# Altium schematic sheet 1608卡-原理图2.SchDoc
size A3
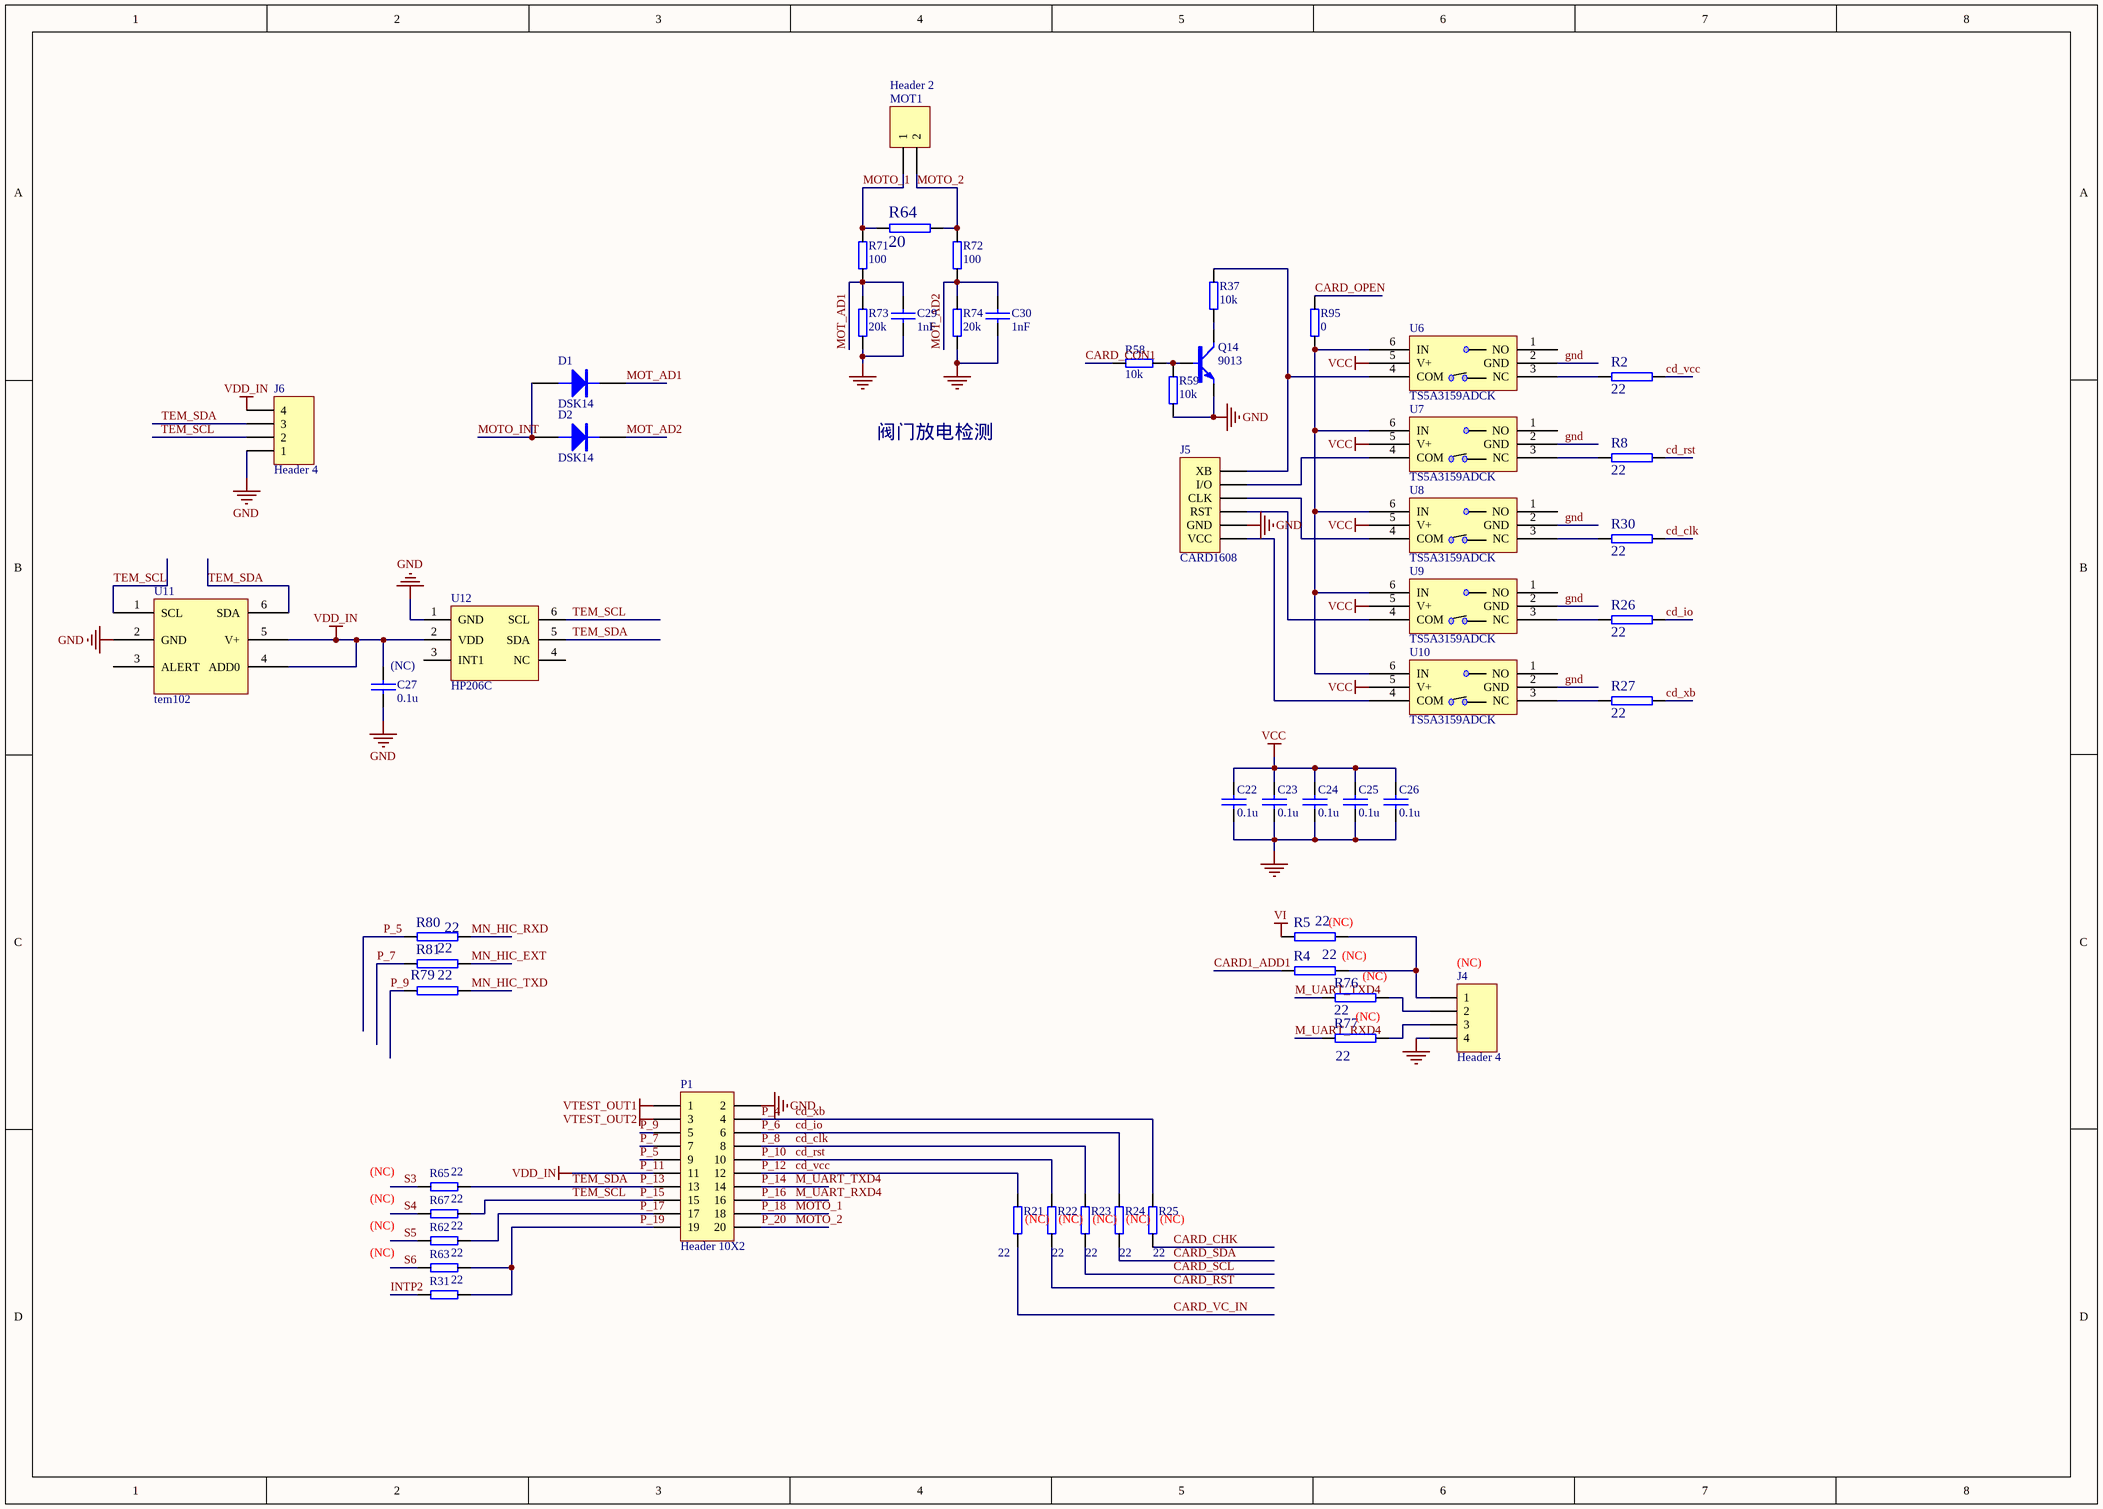
[diagram p0: 1608卡-原理图2.SchDoc]

## Parts
C22  0.1u  [C0603]
C23  0.1u  [C0603]
C24  0.1u  [C0603]
C25  0.1u  [C0603]
C26  0.1u  [C0603]
C27  0.1u  [C0603]
C29  1nF  [C0603]
C30  1nF  [C0603]
D1  DSK14  [LL34]
D2  DSK14  [LL34]
J4  Header 4  [HDX4]
J5  CARD1608  [SMT-1.25-6]
J6  Header 4  [SMT-1.25-4]
MOT1  Header 2  [HDR1X2]
P1  Header 10X2  [HDR2X10]
Q14  9013  [SOT-23-TRAN]
R2  22  [R0603]
R4  22  [R0603]
R5  22  [R0603]
R8  22  [R0603]
R21  22  [R0603]
R22  22  [R0603]
R23  22  [R0603]
R24  22  [R0603]
R25  22  [R0603]
R26  22  [R0603]
R27  22  [R0603]
R30  22  [R0603]
R31  22  [R0603]
R37  10k  [R0603]
R58  10k  [R0603]
R59  10k  [R0603]
R62  22  [R0603]
R63  22  [R0603]
R64  20  [R1206]
R65  22  [R0603]
R67  22  [R0603]
R71  100  [R0603]
R72  100  [R0603]
R73  20k  [R0603]
R74  20k  [R0603]
R76  22  [R0603]
R77  22  [R0603]
R79  22  [R0603]
R80  22  [R0603]
R81  22  [R0603]
R95  0  [R0603]
U6  TS5A3159ADCK  [SOT-23(6)]
U7  TS5A3159ADCK  [SOT-23(6)]
U8  TS5A3159ADCK  [SOT-23(6)]
U9  TS5A3159ADCK  [SOT-23(6)]
U10  TS5A3159ADCK  [SOT-23(6)]
U11  tem102  [SOP6]
U12  HP206C  [HP206C-TEST]

## Nets
gnd: C22.2 C23.2 C24.2 C25.2 C26.2 C27.1 C29.1 C30.1 J4.4 J5.5(GND) J6.1 P1.2 Q14.E R59.2 R73.2 R74.2 U6.2(GND) U7.2(GND) U8.2(GND) U9.2(GND) U10.2(GND) U11.2(GND) U12.1(GND)
P_11: C27.2 J6.4 P1.11 U11.4(ADD0) U11.5(V+) U12.2(VDD)  [also labelled VDD_IN]
VCC: C22.1 C23.1 C24.1 C25.1 C26.1 U6.5(V+) U7.5(V+) U8.5(V+) U9.5(V+) U10.5(V+)
VI: R5.2
VTEST_OUT1: P1.1
VTEST_OUT2: P1.3
CARD1_ADD1: R4.1
CARD_CHK: R25.1
CARD_CON1: R58.2
CARD_OPEN: R95.2
CARD_RST: R22.1
CARD_SCL: R23.1
CARD_SDA: R24.1
CARD_VC_IN: R21.1
cd_clk: P1.8 R23.2 R30.2  [also labelled P_8]
cd_io: P1.6 R24.2 R26.2  [also labelled P_6]
cd_rst: P1.10 R8.2 R22.2  [also labelled P_10]
cd_vcc: P1.12 R2.2 R21.2  [also labelled P_12]
cd_xb: P1.4 R25.2 R27.2  [also labelled P_4]
INTP2: R31.2
M_UART_RXD4: P1.16 R77.1  [also labelled P_16]
M_UART_TXD4: P1.14 R76.1  [also labelled P_14]
MN_HIC_EXT: R81.2
MN_HIC_RXD: R80.2
MN_HIC_TXD: R79.2
MOT_AD1: C29.2 D1.2(K) R71.1 R73.1
MOT_AD2: C30.2 D2.2(K) R72.1 R74.1
MOTO_1: MOT1.1 P1.18 R64.2 R71.2  [also labelled P_18]
MOTO_2: MOT1.2 P1.20 R64.1 R72.2  [also labelled P_20]
MOTO_INT: D1.1(A) D2.1(A)
P_5: P1.9 R80.1
P_7: P1.7 R81.1
P_9: P1.5 R79.1
P_13: J6.3 P1.13 R65.2 U11.6(SDA) U12.5(SDA)  [also labelled TEM_SDA]
P_15: J6.2 P1.15 R67.2 U11.1(SCL) U12.6(SCL)  [also labelled TEM_SCL]
P_17: P1.17 R62.1
P_19: P1.19 R31.1 R63.1
S3: R65.1
S4: R67.1
S5: R62.2
S6: R63.2
NetJ4_1: J4.1 R4.2 R5.1
NetJ4_2: J4.2 R76.2
NetJ4_3: J4.3 R77.2
NetJ5_1: J5.1(XB) R37.2 U6.4(COM)
NetJ5_2: J5.2(I/O) U7.4(COM)
NetJ5_3: J5.3(CLK) U8.4(COM)
NetJ5_4: J5.4(RST) U9.4(COM)
NetJ5_6: J5.6(VCC) U10.4(COM)
NetQ14_B: Q14.B R58.1 R59.1
NetQ14_C: Q14.C R37.1
NetR2_1: R2.1 U6.3(NC)
NetR8_1: R8.1 U7.3(NC)
NetR26_1: R26.1 U9.3(NC)
NetR27_1: R27.1 U10.3(NC)
NetR30_1: R30.1 U8.3(NC)
NetR95_1: R95.1 U6.6(IN) U7.6(IN) U8.6(IN) U9.6(IN) U10.6(IN)

Not connected (* = marked no-connect by the designer): U6 1(NO); U7 1(NO); U8 1(NO); U9 1(NO); U10 1(NO); U11 3(ALERT); U12 3(INT1) 4(NC)

## Notes on the sheet
- 阀门放电检测
- (near C27) (NC)
- (near R5) (NC)
- (NC)
- (near R76) (NC)
- (near J4) (NC)
- (near R25) (NC)

## Library data of the parts
C22-C27 C29 C30 = CAP: 无极性电容
D1 D2 = DIODE
J4 J6 = Header 4: Header, 4-Pin; LatestRevisionDate: 17-Jul-2002; LatestRevisionNote: Re-released for DXP Platform.; Publisher: Altium Limited
J5 = CON6
MOT1 = Header 2: Header, 2-Pin; LatestRevisionDate: 17-Jul-2002; LatestRevisionNote: Re-released for DXP Platform.; Publisher: Altium Limited
P1 = Header 10X2: Header, 10-Pin, Dual row; LatestRevisionDate: 17-Jul-2002; LatestRevisionNote: Re-released for DXP Platform.; Publisher: Altium Limited
Q14 = NPN-S: NPN Transistor
R2 R4 R5 R8 R26 R27 R30 R76 R77 R79-R81 = RES11
R21-R25 R31 R37 R58 R59 R62 R63 R65 R67 R71-R74 R95 = RES
R64 = RES2
U6-U10 = TS5A3159